# Altium schematic sheet Main.SchDoc
size A2
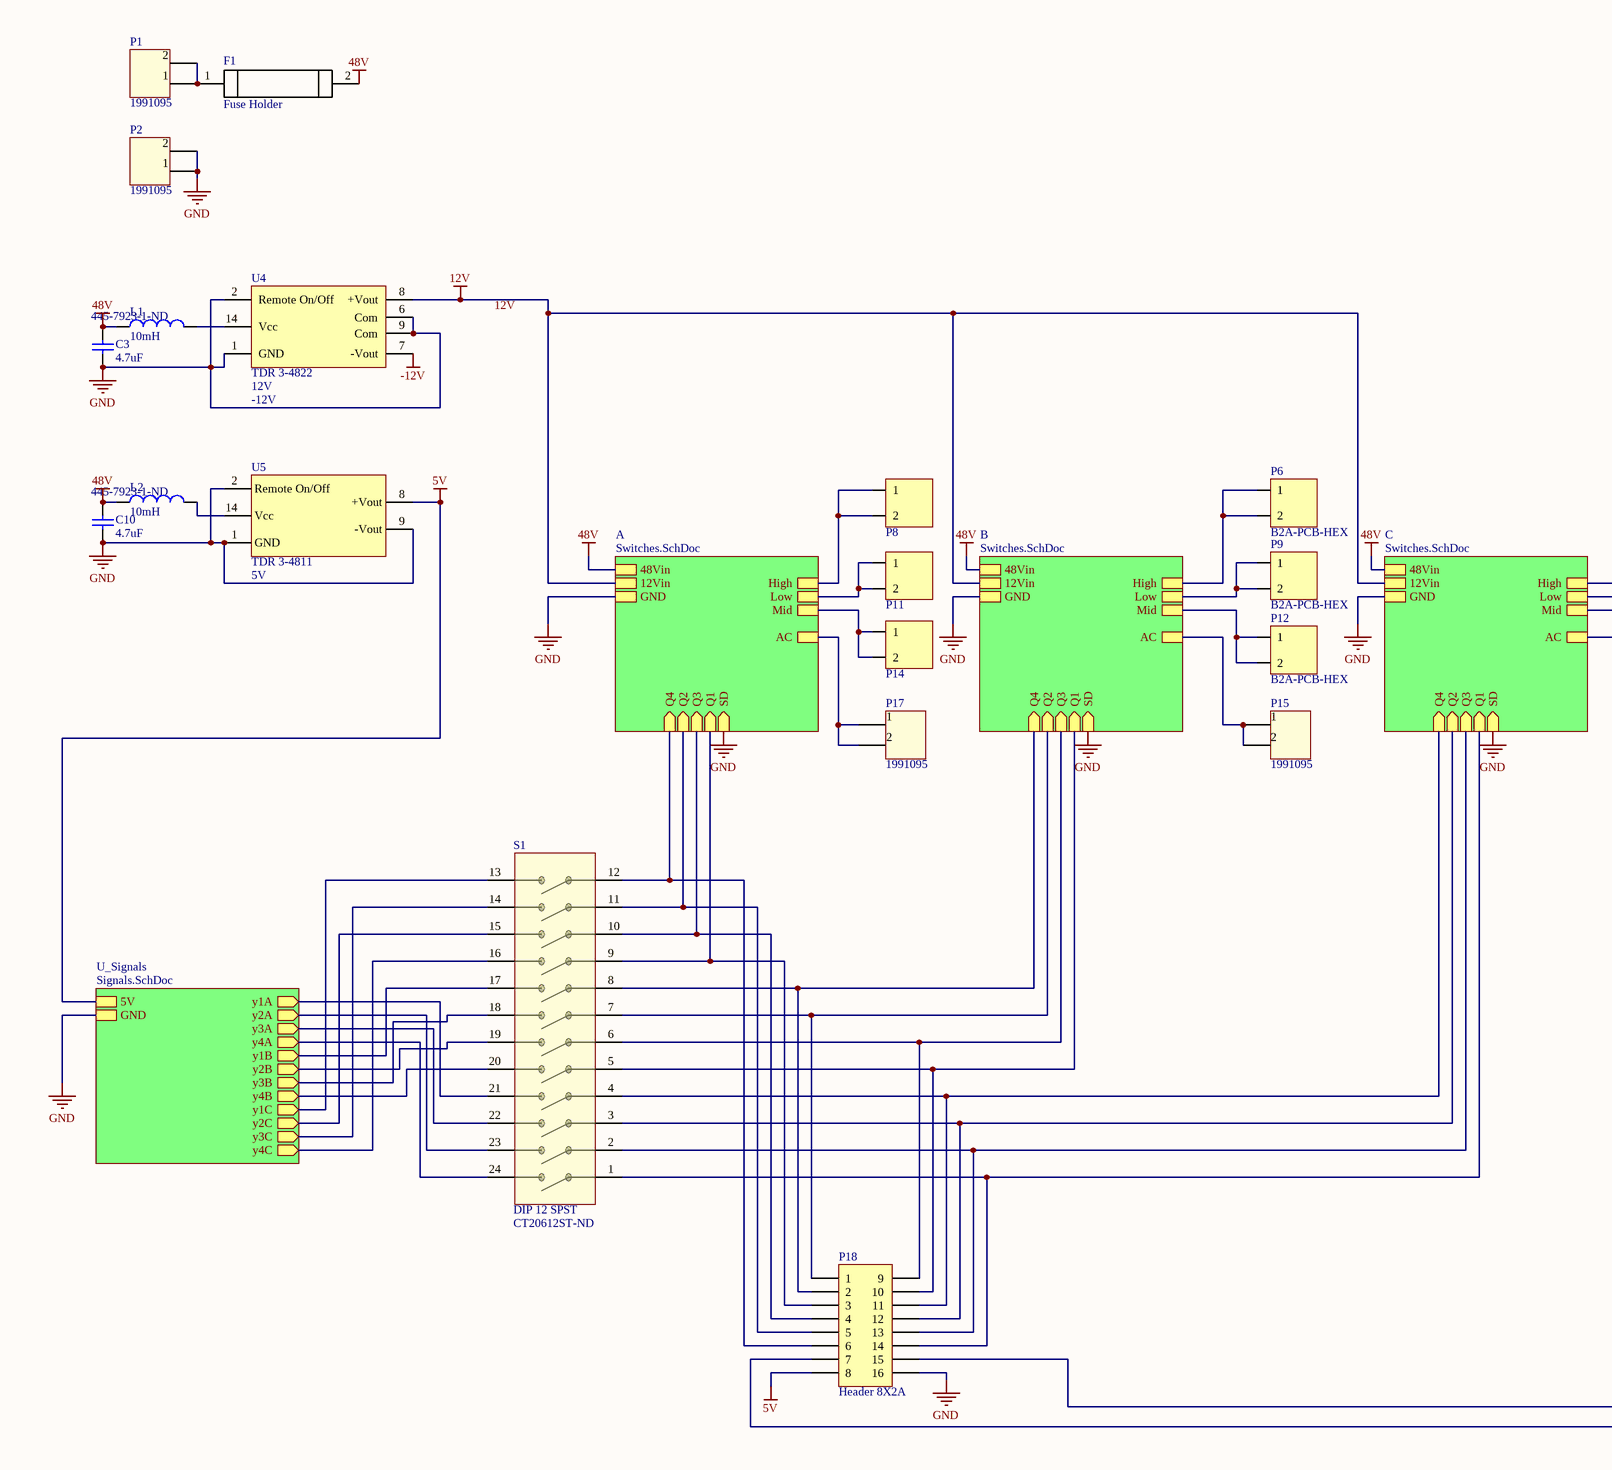
[diagram p0: Main.SchDoc, left]
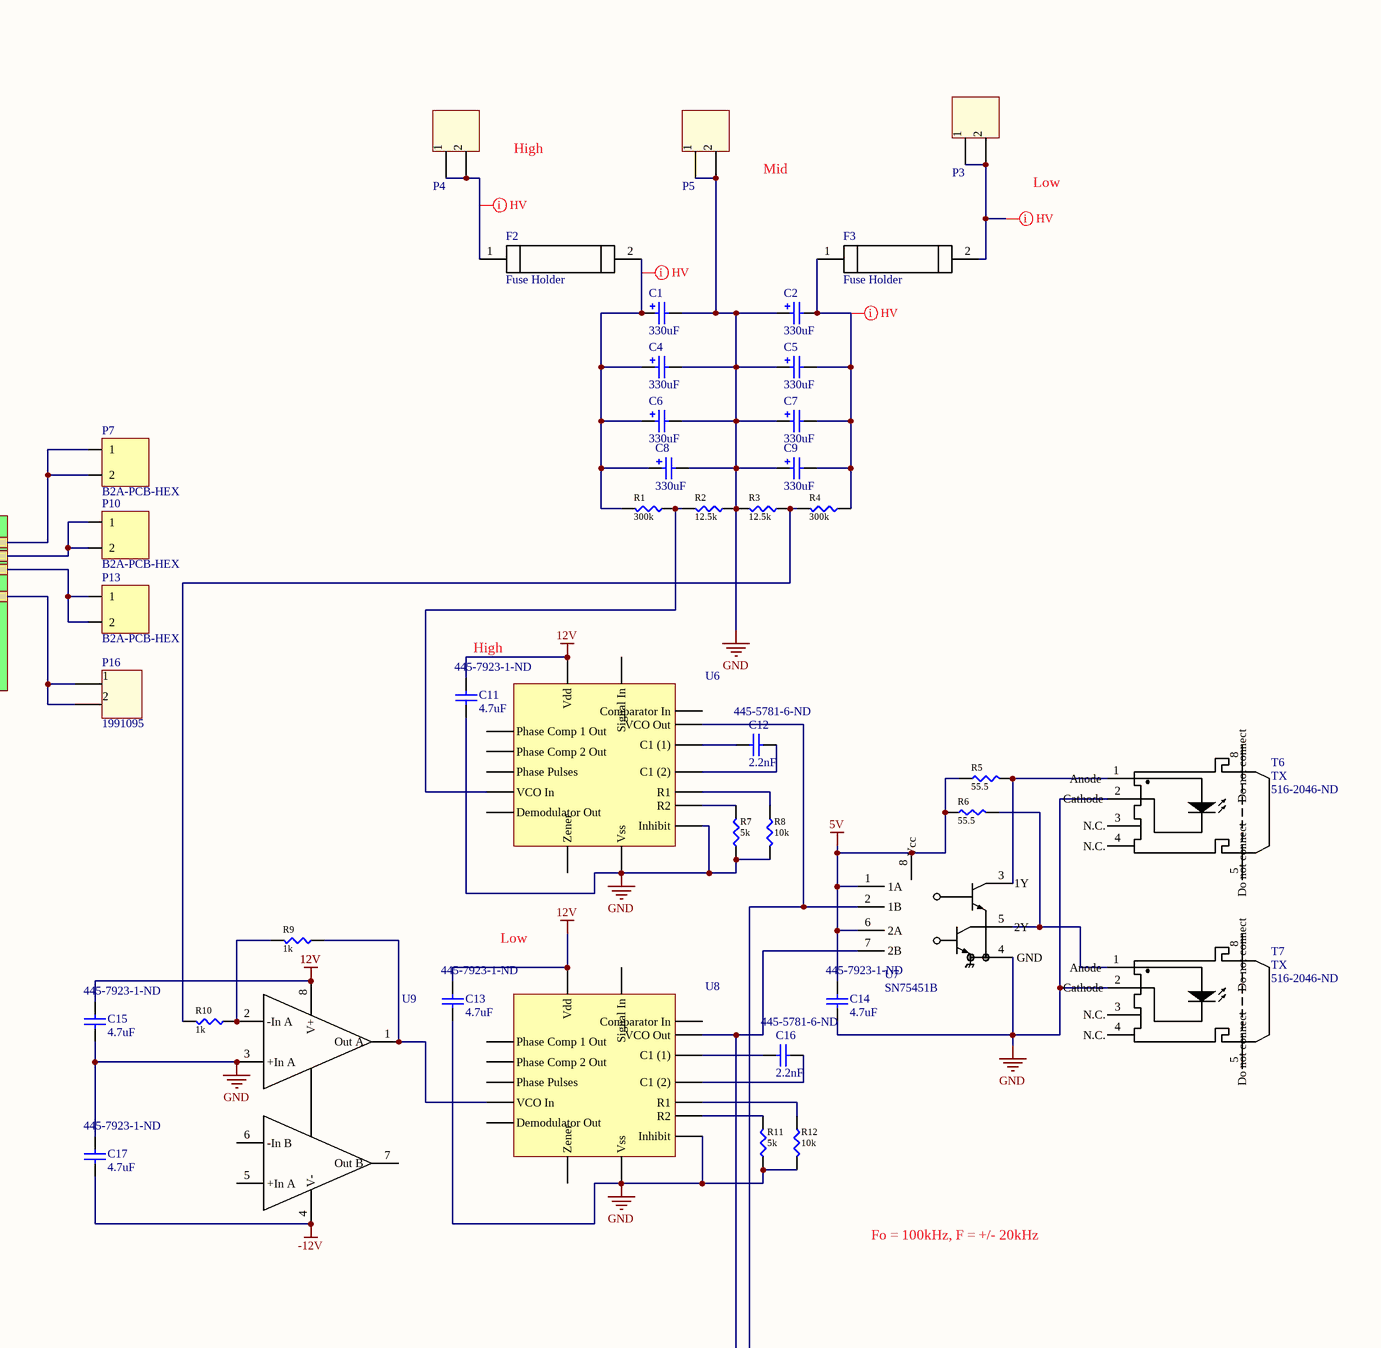
[diagram p1: Main.SchDoc, right]

## Parts
C1  value 330uF  [LGW2G331MELB40]  (hidden comment: Cap Pol1)
C2  value 330uF  [LGW2G331MELB40]  (hidden comment: Cap Pol1)
C3  value 4.7uF  Supplier Part Number 1: 445-7923-1-ND  [C4532]  (hidden comment: Cap)
C4  value 330uF  [LGW2G331MELB40]  (hidden comment: Cap Pol1)
C5  value 330uF  [LGW2G331MELB40]  (hidden comment: Cap Pol1)
C6  value 330uF  [LGW2G331MELB40]  (hidden comment: Cap Pol1)
C7  value 330uF  [LGW2G331MELB40]  (hidden comment: Cap Pol1)
C8  value 330uF  [LGW2G331MELB40]  (hidden comment: Cap Pol1)
C9  value 330uF  [LGW2G331MELB40]  (hidden comment: Cap Pol1)
C10  value 4.7uF  Supplier Part Number 1: 445-7923-1-ND  [C4532]  (hidden comment: Cap)
C11  value 4.7uF  Supplier Part Number 1: 445-7923-1-ND  [C4532]  (hidden comment: Cap)
C12  value 2.2nF  Supplier Part Number 1: 445-5781-6-ND  [R_1206]  (hidden comment: Cap)
C13  value 4.7uF  Supplier Part Number 1: 445-7923-1-ND  [C4532]  (hidden comment: Cap)
C14  value 4.7uF  Supplier Part Number 1: 445-7923-1-ND  [C4532]  (hidden comment: Cap)
C15  value 4.7uF  Supplier Part Number 1: 445-7923-1-ND  [C4532]  (hidden comment: Cap)
C16  value 2.2nF  Supplier Part Number 1: 445-5781-6-ND  [R_1206]  (hidden comment: Cap)
C17  value 4.7uF  Supplier Part Number 1: 445-7923-1-ND  [C4532]  (hidden comment: Cap)
F1  Fuse Holder  [Small Fuse Holder]
F2  Fuse Holder  [Fuse footprint]
F3  Fuse Holder  [Fuse footprint]
L1  value 10mH  [TCK-047]  (hidden comment: Inductor)
L2  value 10mH  [TCK-047]  (hidden comment: Inductor)
P1  1991095  [Terminal Pad]
P2  1991095  [Terminal Pad]
P3  1991095  [Terminal Pad]  (value not drawn)
P4  1991095  [Terminal Pad]  (value not drawn)
P5  1991095  [Terminal Pad]  (value not drawn)
P6  B2A-PCB-HEX  [Terminal Pad]
P7  B2A-PCB-HEX  [Terminal Pad]
P8  B2A-PCB-HEX  [Terminal Pad]  (value not drawn)
P9  B2A-PCB-HEX  [Terminal Pad]
P10  B2A-PCB-HEX  [Terminal Pad]
P11  B2A-PCB-HEX  [Terminal Pad]  (value not drawn)
P12  B2A-PCB-HEX  [Terminal Pad]
P13  B2A-PCB-HEX  [Terminal Pad]
P14  B2A-PCB-HEX  [Terminal Pad]  (value not drawn)
P15  1991095  [Terminal Pad]
P16  1991095  [Terminal Pad]
P17  1991095  [Terminal Pad]
P18  Header 8X2A  [302-S161]
R1  300k  [R_1206]
R2  12.5k  [R_1206]
R3  12.5k  [R_1206]
R4  300k  [R_1206]
R5  55.5  [R_1206]
R6  55.5  [R_1206]
R7  5k  [R_1206]
R8  10k  [R_1206]
R9  1k  [R_1206]
R10  1k  [R_1206]
R11  5k  [R_1206]
R12  10k  [R_1206]
S1  DIP 12 SPST  Supplier Part Number 1: CT20612ST-ND  [DIP12 SPST]
T6  TX  Supplier Part Number 1: 516-2046-ND  [Optics]
T7  TX  Supplier Part Number 1: 516-2046-ND  [Optics]
U4  TDR 3-4822  Voltage - Output 1: 12V  Voltage - Output 2: -12V  [PID DC-DC Converter - duplicate]
U5  TDR 3-4811  Voltage - Output 1: 5V  [PID DC-DC Converter - duplicate]
U6  CD4046B  [DIP16]  (value not drawn)
U7  SN75451B  [R-PDIP-T8]
U8  CD4046B  [DIP16]  (value not drawn)
U9  LT1057CN8  [N8 PDIP]  (value not drawn)

## Sub-sheets
A = Switches.SchDoc: High, Low, Mid, AC, SD (in), 12Vin, GND, 48Vin, Q1 (in), Q3 (in), Q2 (in), Q4 (in)
B = Switches.SchDoc: High, Low, Mid, AC, SD (in), 12Vin, GND, 48Vin, Q1 (in), Q3 (in), Q2 (in), Q4 (in)
C = Switches.SchDoc: High, Low, Mid, AC, SD (in), 12Vin, GND, 48Vin, Q4 (in), Q2 (in), Q3 (in), Q1 (in)
U_Signals = Signals.SchDoc: 5V, GND, y1A (out), y2A (out), y3A (out), y4A (out), y1B (out), y2B (out), y3B (out), y4B (out), y1C (out), y2C (out), y3C (out), y4C (out)

## Nets
5V: C14.2 P18.8 R5.2 R6.2 U5.8(+Vout) U7.1(1A) U7.6(2A) U7.8(Vcc) ; sheet U_Signals/5V
12V: C11.2 C13.2 C15.2 U4.8(+Vout) U6.16(Vdd) U8.16(Vdd) U9.8(V+) ; sheet A/12Vin, sheet B/12Vin, sheet C/12Vin
48V: C3.2 C10.2 F1.2 L1.1 L2.1 ; sheet A/48Vin, sheet B/48Vin, sheet C/48Vin
-12V: C17.1 U4.7(-Vout) U9.4(V-)
GND: C1.2 C2.1 C3.1 C4.2 C5.1 C6.2 C7.1 C8.2 C9.1 C10.1 C11.1 C13.1 C14.1 C15.1 C17.2 P2.1 P2.2 P5.1 P5.2 P18.16 R2.2 R3.1 R7.2 R8.1 R11.2 R12.1 T6.2(Cathode) T7.2(Cathode) U4.1(GND) U4.2(Remote_On/Off) U4.6(Com) U4.9(Com) U5.1(GND) U5.2(Remote_On/Off) U5.9(-Vout) U6.5(Inhibit) U6.8(Vss) U7.4(GND) U8.5(Inhibit) U8.8(Vss) U9.3(+In_A) ; sheet A/SD, sheet A/GND, sheet B/SD, sheet B/GND, sheet C/SD, sheet C/GND, sheet U_Signals/GND
NetC1_1: C1.1 C4.1 C6.1 C8.1 F2.2 R1.1
NetC2_2: C2.2 C5.2 C7.2 C9.2 F3.1 R4.2
NetC12_1: C12.1 U6.6(C1_(1))
NetC12_2: C12.2 U6.7(C1_(2))
NetC16_1: C16.1 U8.6(C1_(1))
NetC16_2: C16.2 U8.7(C1_(2))
NetF1_1: F1.1 P1.1 P1.2
NetF2_1: F2.1 P4.1 P4.2
NetF3_2: F3.2 P3.1 P3.2
NetL1_2: L1.2 U4.14(Vcc)
NetL2_2: L2.2 U5.14(Vcc)
NetP6_1: P6.1 P6.2 ; sheet B/High
NetP7_1: P7.1 P7.2 ; sheet C/High
NetP8_1: P8.1 P8.2 ; sheet A/High
NetP9_1: P9.1 P9.2 ; sheet B/Low
NetP10_1: P10.1 P10.2 ; sheet C/Low
NetP11_1: P11.1 P11.2 ; sheet A/Low
NetP12_1: P12.1 P12.2 ; sheet B/Mid
NetP13_1: P13.1 P13.2 ; sheet C/Mid
NetP14_1: P14.1 P14.2 ; sheet A/Mid
NetP15_1: P15.1 P15.2 ; sheet B/AC
NetP16_1: P16.1 P16.2 ; sheet C/AC
NetP17_1: P17.1 P17.2 ; sheet A/AC
NetP18_1: P18.1 S1.7 ; sheet B/Q2
NetP18_2: P18.2 S1.8 ; sheet B/Q4
NetP18_3: P18.3 S1.9 ; sheet A/Q1
NetP18_4: P18.4 S1.10 ; sheet A/Q3
NetP18_5: P18.5 S1.11 ; sheet A/Q2
NetP18_6: P18.6 S1.12 ; sheet A/Q4
NetP18_7: P18.7 U6.4(VCO_Out) U7.2(1B)
NetP18_9: P18.9 S1.6 ; sheet B/Q3
NetP18_10: P18.10 S1.5 ; sheet B/Q1
NetP18_11: P18.11 S1.4 ; sheet C/Q4
NetP18_12: P18.12 S1.3 ; sheet C/Q2
NetP18_13: P18.13 S1.2 ; sheet C/Q3
NetP18_14: P18.14 S1.1 ; sheet C/Q1
NetP18_15: P18.15 U7.7(2B) U8.4(VCO_Out)
NetR1_2: R1.2 R2.1 U6.9(VCO_In)
NetR3_2: R3.2 R4.1 R10.1
NetR5_1: R5.1 T6.1(Anode) U7.3(1Y)
NetR6_1: R6.1 T7.1(Anode) U7.5(2Y)
NetR7_1: R7.1 U6.12(R2)
NetR8_2: R8.2 U6.11(R1)
NetR9_1: R9.1 R10.2 U9.2(-In_A)
NetR9_2: R9.2 U8.9(VCO_In) U9.1(Out_A)
NetR11_1: R11.1 U8.12(R2)
NetR12_2: R12.2 U8.11(R1)
NetS1_13: S1.13 ; sheet U_Signals/y1C
NetS1_14: S1.14 ; sheet U_Signals/y3C
NetS1_15: S1.15 ; sheet U_Signals/y2C
NetS1_16: S1.16 ; sheet U_Signals/y4C
NetS1_17: S1.17 ; sheet U_Signals/y1B
NetS1_18: S1.18 ; sheet U_Signals/y3B
NetS1_19: S1.19 ; sheet U_Signals/y2B
NetS1_20: S1.20 ; sheet U_Signals/y4B
NetS1_21: S1.21 ; sheet U_Signals/y1A
NetS1_22: S1.22 ; sheet U_Signals/y3A
NetS1_23: S1.23 ; sheet U_Signals/y2A
NetS1_24: S1.24 ; sheet U_Signals/y4A

Not connected (* = marked no-connect by the designer): T6 3(N.C.) 4(N.C.) 5(Do_not_connect) 8(Do_not_connect); T7 3(N.C.) 4(N.C.) 5(Do_not_connect) 8(Do_not_connect); U6 1(Phase_Pulses) 2(Phase_Comp_1_Out) 3(Comparator_In) 10(Demodulator_Out) 13(Phase_Comp_2_Out) 14(Signal_In) 15(Zener); U8 1(Phase_Pulses) 2(Phase_Comp_1_Out) 3(Comparator_In) 10(Demodulator_Out) 13(Phase_Comp_2_Out) 14(Signal_In) 15(Zener); U9 5(+In_A) 6(-In_B) 7(Out_B)

## Layout directives
net class HV: NetC1_1, NetC2_2, NetF2_1, NetF3_2

## Notes on the sheet
- (near P4) High
- (near P5) Mid
- Low
- High
- Fo = 100kHz, F = +/- 20kHz
- Labels drawn without touching a wire or pin: 12V

## Library data of the parts
C1 C2 C4-C9 = Cap Pol1: Polarized Capacitor (Radial); Manufacturer: Nichicon; Voltage Rating: 400V; Tolerance: 20%; Ripple Current: 2.33A; Polarity: Polar; Leakage Current: 1.08mA; Life (Hours): 3000Hour; Lead Diameter: 0.8mm; Published: 8-Jun-2000; LatestRevisionDate: 17-Jul-2002; LatestRevisionNote: Re-released for DXP Platform.; PackageReference: RB7.6-15; Publisher: Altium Limited; PackageDescription: Polarized Capacitor (Radial); 2 Leads; Supplier 1: Digi-Key; Supplier Part Number 1: 493-3229-ND; Manufacturer Part Number: LGW2G331MELB40; Stock 1: 0; Pricing 1: 1=6.67, 10=5.926, 100=4.7406, 500=4.074, 1000=3.8377 (USD); Mount: Through Hole; Case/Package: Radial; Min Operating Temperature: -25°C; Max Operating Temperature: 105°C; Package Quantity: 200; Capacitance: 330uF; Packaging: Bulk; Termination: Snap in; Voltage: 400V; Diameter: 30mm; Length: 40mm; Height: 40mm; Lead Pitch: 10mm; Height - Seated (Max): 1.575inch; ComponentLink1URL: https://datasheet.ciiva.com/101/e-gw-101040.pdf; ComponentLink1Description: https://datasheet.ciiva.com/101/e-gw-101040.pdf; ComponentLink2URL: https://datasheet.ciiva.com/5376/e-gw-28778-5376397.pdf; ComponentLink2Description: https://datasheet.ciiva.com/5376/e-gw-28778-5376397.pdf
C3 C10 C11 C13-C15 C17 = Cap: Capacitor; Manufacturer: TDK; Manufacturer Part Number: CGA8N3X7S2A475K230KB; Tolerance: 10%; Voltage Rating: 100V; Dielectric: X7S; Published: 8-Jun-2000; LatestRevisionDate: 17-Jul-2002; LatestRevisionNote: Re-released for DXP Platform.; PackageReference: RAD-0.3; Publisher: Altium Limited; PackageDescription: Radial Cap, Thru-Hole; 2 Leads; 0.3 in Pin Spacing; Supplier 1: Digi-Key; Pricing 1: 1=1.92, 10=1.518, 100=1.1385 (USD); Case/Package: 1812; Weight: 0.000952oz; Case Code (Metric): 4532; Case Code (Imperial): 1812; Min Operating Temperature: -55°C; Max Operating Temperature: 125°C; Packaging: Tape and Reel; Capacitance: 4.7uF; Termination: SMD/SMT; Package Quantity: 1; Voltage Rating (DC): 100V; Composition: Ceramic; Length: 4.5mm; Height: 1.6mm; Width: 0.126inch; Thickness: 0.091inch; Depth: 3.2mm; REACH SVHC: No SVHC; ComponentLink1URL: https://datasheet.ciiva.com/24217/cga8n3x7s2a475k230kb-266118-24217101.pdf; ComponentLink1Description: https://datasheet.ciiva.com/24217/cga8n3x7s2a475k230kb-266118-24217101.pdf
  C3 C10: Stock 1: 236
  C11 C13-C15 C17: Stock 1: 0
C12 C16 = Cap: Capacitor; Manufacturer: TDK; Manufacturer Part Number: CGA5C4C0G2J221J060AA; Capacitance: 220pF; Tolerance: 5%; Voltage Rating: 630V; Dielectric: C0G; Supplier 1: Digi-Key; Stock 1: 13089; Pricing 1: 1=0.33, 10=0.228, 100=0.129, 500=0.0911, 1000=0.0797 (USD); Case/Package: 1206; Weight: 0.000571oz; Case Code (Metric): 3216; Case Code (Imperial): 1206; Min Operating Temperature: -55°C; Max Operating Temperature: 125°C; Packaging: Tape and Reel; Voltage Rating (DC): 630V; Termination: SMD/SMT; Package Quantity: 1; Composition: Ceramic; Length: 3.2mm; Height: 0.6mm; Width: 0.063inch; Thickness: 0.03inch; Depth: 1.6mm; REACH SVHC: No SVHC; ComponentLink1URL: http://www.farnell.com/datasheets/2130384.pdf; ComponentLink1Description: http://www.farnell.com/datasheets/2130384.pdf; ComponentLink2URL: http://components.arrow.com/part/dataview/57435972S460237N1165; ComponentLink2Description: http://components.arrow.com/part/dataview/57435972S460237N1165; ComponentLink3URL: http://components.arrow.com/part/dataview/0323_06888476; ComponentLink3Description: http://components.arrow.com/part/dataview/0323_06888476; ComponentLink4URL: http://www.mouser.com/ds/2/400/lcc_automotive_midvoltage_en-355485.pdf; ComponentLink4Description: http://www.mouser.com/ds/2/400/lcc_automotive_midvoltage_en-355485.pdf; ComponentLink5URL: http://product.tdk.com/en/catalog/spec/mlccspec_automotive_general_midvoltage_en.pdf; ComponentLink5Description: http://product.tdk.com/en/catalog/spec/mlccspec_automotive_general_midvoltage_en.pdf; ComponentLink6URL: http://www.farnell.com/datasheets/1807242.pdf; ComponentLink6Description: http://www.farnell.com/datasheets/1807242.pdf; ComponentLink7URL: http://www.tdk.co.jp/tefe02/e413_cga.pdf; ComponentLink7Description: http://www.tdk.co.jp/tefe02/e413_cga.pdf
F1-F3 = Fuse Holder: Manufacturer: Littelfuse; Manufacturer Part Number: 01220093Z; Body Material: Copper; Material: Copper,Tin; Current Rating: 30A; Voltage Rating: 250V; Number of Circuits: 1; Supplier 1: Digi-Key; Stock 1: 10489; Pricing 1: 1=0.72, 5=0.696, 10=0.674, 50=0.5672, 100=0.4708, 250=0.428, 500=0.3638, 1000=0.321, 5000=0.2889 (USD); Mount: Horizontal,PCB; Packaging: Bulk; Package Quantity: 1000; Termination: PC Pin; Voltage: 250V; Length: 7.11mm; Height: 10.67mm; Width: 7.87mm; Depth: 9.4mm; Lead Free: Lead Free; ComponentLink1URL: https://datasheet.ciiva.com/295/littelfuse-fuse-clips-295529.pdf; ComponentLink1Description: https://datasheet.ciiva.com/295/littelfuse-fuse-clips-295529.pdf; Supplier Part Number 1: F4185-ND
L1 L2 = Inductor: Code_IEC: 1005; Published: 8-Jun-2000; LatestRevisionDate: 29-May-2009; LatestRevisionNote: IPC-7351 Footprint Added.; PackageReference: 0402-A; Publisher: Altium Limited; PackageDescription: Chip Inductor; Code_JEITA: 0402
P1-P5 P15-P17 = Terminal Block 2: 2 way terminal block; Manufacturer: Phoenix Contact; Number of Contacts: 2; Wire Gauge (Max): 24AWG; Wire Gauge (Min): 12AWG; Voltage Rating: 400V; Current Rating: 24A; Number of Levels: 1; Current: 20A; Voltage: 300V; Pitch: 5mm; Approvals: UL; Supplier 1: Digi-Key; Manufacturer Part Number: 1991095; Stock 1: 1914; Pricing 1: 1=1.13, 10=1.078, 50=1.0486, 100=0.98, 250=0.9016, 500=0.833, 1000=0.7938, 2500=0.7448 (USD); Mount: Through Hole; Weight: 0.102294oz; Colour: Green; Housing Colour: Green; Housing Material: Nylon; Termination: Screwless; Package Quantity: 100; Packaging: Bulk; Number of Poles: 2; Number of Positions Per Level: 2; Number of Positions: 2; Number of Rows: 1; Max Current Rating: 24A; Number of Circuits: 2; Orientation: Straight; Length: 11.4mm; Width: 14.4mm; Depth: 13.5mm; Lead Free: Lead Free; ComponentLink1URL: https://datasheet.ciiva.com/6752/1991095-6752880.pdf; ComponentLink1Description: https://datasheet.ciiva.com/6752/1991095-6752880.pdf; ComponentLink2URL: https://datasheet.ciiva.com/16051/1991095-16051374.pdf; ComponentLink2Description: https://datasheet.ciiva.com/16051/1991095-16051374.pdf; ComponentLink3URL: https://datasheet.ciiva.com/29222/774864-da-01-en-printklemme-1991095-100-st-29222380.pdf; ComponentLink3Description: https://datasheet.ciiva.com/29222/774864-da-01-en-printklemme-1991095-100-st-29222380.pdf; Supplier Part Number 1: 277-6267-ND
P18 = Header 8X2A: Header, 8-Pin, Dual row; Manufacturer: On-Shore Technology; Description: 16 Positions Header, Shrouded Connector 0.100" (2.54mm) Through Hole Gold; Number of Positions: 16; Connector Type: Male Pin; Pitch: 0.1inch; LatestRevisionDate: 17-Jul-2002; LatestRevisionNote: Re-released for DXP Platform.; Publisher: Altium Limited; Supplier 1: Digi-Key; Manufacturer Part Number: 302-S161; Stock 1: 8758; Pricing 1: 1=0.4, 10=0.375, 100=0.2622, 500=0.2247, 1000=0.1873, 5000=0.1605, 10000=0.1498 (USD); Mount: Through Hole; Case/Package: 100; Colour: Black; Contact Plating: Gold; Number of Rows: 2; Packaging: Tray; Termination: Solder; Row Spacing: 0.1inch; ComponentLink1URL: https://datasheet.ciiva.com/742/302-sxxx-742189.pdf; ComponentLink1Description: https://datasheet.ciiva.com/742/302-sxxx-742189.pdf
R1-R12 = RES_SMD1: RES SMD 1% 1/4W 1206; Manufacturer: Panasonic Electronic Components; Manufacturer Part Number: ERJ-8ENF9101V; Power (Watts): 0.25W, 1/4W; Temperature Coefficient: ±100ppm/°C; Supplier 1: Digi-Key; RoHS: RoHS Compliant; Category: Resistors; Stock 1: 17632; Pricing 1: 1=0.15, 50=0.0424, 100=0.0313, 250=0.02384, 500=0.01908, 1000=0.01404 (CAD); Packaging: Digi-Reel®; Part Status: Active; Tolerance: ±1%; Composition: Thick Film; Features: Automotive AEC-Q200; Operating Temperature: -55°C ~ 155°C; Package / Case: 1206 (3216 Metric); Supplier Device Package: 1206; Size / Dimension: 0.126" L x 0.063" W (3.20mm x 1.60mm); Height: 0.028" (0.70mm); Number of Terminations: 2; Failure Rate: -; ComponentLink1URL: http://industrial.panasonic.com/www-cgi/jvcr13pz.cgi?E+PZ+3+AOA0002+ERJ8ENF9101V+7+WW; ComponentLink1Description: http://industrial.panasonic.com/www-cgi/jvcr13pz.cgi?E+PZ+3+AOA0002+ERJ8ENF9101V+7+WW; Supplier Part Number 1: P9.10KFDKR-ND
  R1 R4: Value: 300k
  R2 R3: Value: 12.5k
  R5 R6: Value: 55.5
  R7 R11: Value: 5k
  R8 R12: Value: 10k
  R9 R10: Value: 1k
S1 = DIP 12 SPST: Manufacturer: CTS Electrocomponents; Manufacturer Part Number: 206-12ST; Body Material: Plastic; Number of Positions: 12; Voltage Rating (DC): 24V; Max Current Rating: 50mA; Electrical Life: 10000Cycles; Pitch: 0.1inch; Washable: Yes; Supplier 1: Digi-Key; Stock 1: 2620; Pricing 1: 1=1.41, 10=1.33, 25=1.2752, 50=1.194, 100=1.1668, 250=1.0312, 500=0.9769, 1000=0.8684, 5000=0.7598 (USD); Mount: Through Hole; Case/Package: DIP; Contact Plating: Tin,Gold; Contact Material: Copper; Min Operating Temperature: -55°C; Max Operating Temperature: 85°C; Packaging: Rail/Tube; Termination: PC Pin; Throw Configuration: SPST; Package Quantity: 15; Orientation: Straight; Current Rating: 50mA; Length: 1.286inch; Depth: 9.78mm; Terminal Pitch: 2.54mm; Radiation Hardening: No; Lead Free: Lead Free; ComponentLink1URL: https://datasheet.ciiva.com/26926/getdatasheetpartid-771341-26926550.pdf; ComponentLink1Description: https://datasheet.ciiva.com/26926/getdatasheetpartid-771341-26926550.pdf; ComponentLink2URL: https://datasheet.ciiva.com/2864/206-208-2864231.pdf; ComponentLink2Description: https://datasheet.ciiva.com/2864/206-208-2864231.pdf; ComponentLink3URL: https://datasheet.ciiva.com/15184/getdatasheetpartid-112074-15184826.pdf; ComponentLink3Description: https://datasheet.ciiva.com/15184/getdatasheetpartid-112074-15184826.pdf; ComponentLink4URL: https://datasheet.ciiva.com/17068/206-208-17068348.pdf; ComponentLink4Description: https://datasheet.ciiva.com/17068/206-208-17068348.pdf
T6 T7 = HFBR-1524Z: Otical Transmitter; Manufacturer: Broadcom Avago; Wavelength: 660nm; Capacitance: 86pF; Forward Voltage: 1.67V; Data Rate: 1Mbps; Reverse Voltage (DC): 5V; Forward Current: 80mA; Max Output Current: 5.1mA; Rise Time: 80ns; Fall Time: 40ns; Supplier 1: Digikey; Manufacturer Part Number: HFBR-1524Z; Stock 1: 1574; Pricing 1: 1=11.66, 10=10.56, 25=8.36, 100=7.04, 250=6.6, 500=6.05, 1000=5.72 (USD); Mount: Through Hole; Case/Package: 600; Number of Pins: 6; Min Operating Temperature: -40°C; Max Operating Temperature: 85°C; Package Quantity: 200; Supply Voltage: 5V; Packaging: Rail/Tube; Length: 18.8mm; Height: 7.62mm; Width: 10.2mm; Radiation Hardening: No; REACH SVHC: No SVHC; Lead Free: Lead Free; ComponentLink1URL: https://datasheet.ciiva.com/27056/2062150-27056536.pdf; ComponentLink1Description: https://datasheet.ciiva.com/27056/2062150-27056536.pdf; ComponentLink2URL: https://datasheet.ciiva.com/18408/70158101-18408620.pdf; ComponentLink2Description: https://datasheet.ciiva.com/18408/70158101-18408620.pdf; ComponentLink3URL: https://datasheet.ciiva.com/26913/hfbr-1524z-26913686.pdf; ComponentLink3Description: https://datasheet.ciiva.com/26913/hfbr-1524z-26913686.pdf
U4 = TDR 3-4822: 48 +/-12V Converter; Manufacturer: Traco Power; Min Input Voltage (DC): 36V; Max Input Voltage: 75V; Number of Outputs: 2; Max Output Current: 125mA; Nominal Input Voltage: 48V; Efficiency: 82%; Max Output Power: 3W; Isolation Voltage: 1.5kV; Isolation: Isolated; Supplier 1: Newark; Manufacturer Part Number: TDR3-4822; Stock 1: 10; Pricing 1: 1=31.75, 25=29.09, 50=27.03, 100=26.14, 250=25.25 (USD); Case/Package: DIP; Number of Pins: 7; Min Operating Temperature: -40°C; Max Operating Temperature: 85°C; Nominal Output Voltage: -12V; Min Input Voltage: 36V; Max Input Voltage (DC): 75V; Output Voltage: 12V; Output Current: 125mA; Current - Output 1: 125mA; Current - Output 2: 125mA; Packaging: Rail/Tube; Length: 18.9mm; Height: 8.7mm; Width: 12.8mm; Depth: 18.9mm; REACH SVHC: No SVHC; ComponentLink1URL: http://components.arrow.com/part/dataview/0323_02838307; ComponentLink1Description: http://components.arrow.com/part/dataview/0323_02838307; ComponentLink2URL: http://www.farnell.com/datasheets/1763516.pdf; ComponentLink2Description: http://www.farnell.com/datasheets/1763516.pdf; ComponentLink3URL: http://uk.rs-online.com/webdocs/0e35/0900766b80e35ed7.pdf; ComponentLink3Description: http://uk.rs-online.com/webdocs/0e35/0900766b80e35ed7.pdf; ComponentLink4URL: http://docs-usa.electrocomponents.com/techlib:/itc_doclist_US.htm?stockno=7065629; ComponentLink4Description: http://docs-usa.electrocomponents.com/techlib:/itc_doclist_US.htm?stockno=7065629; Supplier Part Number 1: 20X0418
U5 = TDR 3-4811: 48V-5V Converter; Manufacturer: Traco Power; Nominal Input Voltage: 48V; Output Current: 600mA; Number of Outputs: 1; Efficiency: 81%; Min Input Voltage: 36V; Max Input Voltage: 75V; Max Output Power: 3W; Isolation Voltage: 1.5kV; Isolation: Isolated; Supplier 1: Mouser; Manufacturer Part Number: TDR3-4811; Stock 1: 10; Pricing 1: 1=31.28, 10=29.54, 50=25.71, 100=25.71, 1000=25.71, 10000=25.71 (USD); Case/Package: DIP; Number of Pins: 7; Min Operating Temperature: -40°C; Max Operating Temperature: 85°C; Output Voltage: 5V; Nominal Output Voltage: 5V; Max Output Current: 600mA; Min Input Voltage (DC): 36V; Max Input Voltage (DC): 75V; Current - Output 1: 600mA; Packaging: Rail/Tube; Length: 18.9mm; Height: 8.7mm; Width: 12.8mm; Depth: 18.9mm; REACH SVHC: No SVHC; ComponentLink1URL: https://datasheet.ciiva.com/28438/1763516-28438522.pdf; ComponentLink1Description: https://datasheet.ciiva.com/28438/1763516-28438522.pdf; Supplier Part Number 1: 495-TDR3-4811
U6 U8 = CD4046B: VCO; Manufacturer: Texas Instruments; Manufacturer Part Number: CD4046BE; Max Supply Voltage: 18V; Min Supply Voltage: 3V; Number of Elements: 1; Frequency: 2.4MHz; Nominal Supply Current: 10mA; Input: CMOS; PLL: Yes; Supplier 1: Digikey; Stock 1: 1216; Pricing 1: 1=0.56, 10=0.476, 100=0.3556, 500=0.2794, 1000=0.2159 (USD); Mount: Through Hole; Case/Package: DIP; Number of Pins: 16; Weight: 0.03357oz; Contact Plating: Gold; Min Operating Temperature: -55°C; Max Operating Temperature: 125°C; Packaging: Rail/Tube; Number of Circuits: 1; Number of Bits: 1; Package Quantity: 25; Max Frequency: 2.4MHz; Radiation Hardening: No; Lead Free: Lead Free; REACH SVHC: No SVHC; ComponentLink1URL: https://datasheet.ciiva.com/14134/cd4046b-eng-tds-14134658.pdf; ComponentLink1Description: https://datasheet.ciiva.com/14134/cd4046b-eng-tds-14134658.pdf; ComponentLink2URL: https://datasheet.ciiva.com/15153/getdatasheetpartid-241639-15153402.pdf; ComponentLink2Description: https://datasheet.ciiva.com/15153/getdatasheetpartid-241639-15153402.pdf; ComponentLink3URL: https://datasheet.ciiva.com/14247/cd4046b-14247052.pdf; ComponentLink3Description: https://datasheet.ciiva.com/14247/cd4046b-14247052.pdf; ComponentLink4URL: https://datasheet.ciiva.com/26229/cd4046b-mil-26229407.pdf; ComponentLink4Description: https://datasheet.ciiva.com/26229/cd4046b-mil-26229407.pdf; ComponentLink5URL: https://datasheet.ciiva.com/27050/817951-27050191.pdf; ComponentLink5Description: https://datasheet.ciiva.com/27050/817951-27050191.pdf; ComponentLink6URL: https://datasheet.ciiva.com/29297/172880-da-01-en-c-mos-ic-cd4046be-dip16-tid-29297245.pdf; ComponentLink6Description: https://datasheet.ciiva.com/29297/172880-da-01-en-c-mos-ic-cd4046be-dip16-tid-29297245.pdf; Supplier Part Number 1: 296-2052-5-ND
U7 = SN75451B: Dual Peripheral Drivers; Manufacturer: Texas Instruments; Manufacturer Part Number: SN75451BP; Number of Outputs: 2; Output Voltage: 30V; Output Current: 400mA; Propagation Delay: 25ns; Nominal Supply Current: 65mA; Turn-On Delay Time: 8ns; Turn-Off Delay Time: 12ns; Max Input Voltage: 5.5V; Max Power Dissipation: 1W; Min Supply Voltage: 4.75V; Max Supply Voltage: 5.25V; Supplier 1: Digi-Key; Stock 1: 2217; Pricing 1: 1=0.89, 10=0.794, 100=0.6187, 500=0.5111, 1000=0.4035 (USD); Case/Package: PDIP; Number of Pins: 8; Weight: 0.015535oz; Min Operating Temperature: 0°C; Max Operating Temperature: 70°C; Packaging: Rail/Tube; Package Quantity: 50; Number of Drivers: 2; Power Dissipation: 1W; Max Supply Current: 65mA; Length: 9.81mm; Height: 4.57mm; Width: 6.35mm; Radiation Hardening: No; Lead Free: Lead Free; REACH SVHC: No SVHC; ComponentLink1URL: https://datasheet.ciiva.com/1501/1387986-1501952.pdf; ComponentLink1Description: https://datasheet.ciiva.com/1501/1387986-1501952.pdf; ComponentLink2URL: https://datasheet.ciiva.com/1609/slrs021b-1609184.pdf; ComponentLink2Description: https://datasheet.ciiva.com/1609/slrs021b-1609184.pdf; ComponentLink3URL: https://datasheet.ciiva.com/15115/getdatasheetpartid-134903-15115475.pdf; ComponentLink3Description: https://datasheet.ciiva.com/15115/getdatasheetpartid-134903-15115475.pdf; ComponentLink4URL: https://datasheet.ciiva.com/14180/nr645830-645832-e-14180149.pdf; ComponentLink4Description: https://datasheet.ciiva.com/14180/nr645830-645832-e-14180149.pdf; ComponentLink5URL: https://datasheet.ciiva.com/3303/sn75453b-3303271.pdf; ComponentLink5Description: https://datasheet.ciiva.com/3303/sn75453b-3303271.pdf; ComponentLink6URL: https://datasheet.ciiva.com/16470/sn75453b-16470791.pdf; ComponentLink6Description: https://datasheet.ciiva.com/16470/sn75453b-16470791.pdf; ComponentLink7URL: https://datasheet.ciiva.com/26229/sn75453b-26229559.pdf; ComponentLink7Description: https://datasheet.ciiva.com/26229/sn75453b-26229559.pdf; ComponentLink8URL: https://datasheet.ciiva.com/19477/1054748-19477417.pdf; ComponentLink8Description: https://datasheet.ciiva.com/19477/1054748-19477417.pdf; ComponentLink9URL: https://datasheet.ciiva.com/1949/sn75452b-1949982.pdf; ComponentLink9Description: https://datasheet.ciiva.com/1949/sn75452b-1949982.pdf; ComponentLink10URL: https://datasheet.ciiva.com/1501/1829915-1501951.pdf; ComponentLink10Description: https://datasheet.ciiva.com/1501/1829915-1501951.pdf; ComponentLink11URL: https://datasheet.ciiva.com/41462/001014510-da-01-en-ic-dual-peripheral-sn75451bp-pdip-8-tid-41462363.pdf; ComponentLink11Description: https://datasheet.ciiva.com/41462/001014510-da-01-en-ic-dual-peripheral-sn75451bp-pdip-8-tid-41462363.pdf; Supplier Part Number 1: 296-1746-5-ND
U9 = LT1057CN8: Dual Op-Amp; Manufacturer: STMicroelectronics; Manufacturer Part Number: LMV321LICT; Min Supply Voltage: 2.7V; Max Supply Voltage: 5.5V; Voltage Gain: 100dB; Common Mode Rejection Ratio: 72dB; Gain Bandwidth Product: 1.3MHz; Slew Rate: 0.7V/µs; Number of Channels: 1; Output Current: 46mA; Nominal Supply Current: 220uA; Input Bias Current: 27nA; Input Offset Voltage (Vos): 1mV; Operating Supply Current: 130uA; Output Current per Channel: 70mA; Dual Supply Voltage: 9V; Min Dual Supply Voltage: 4V; Max Dual Supply Voltage: 20V; Nominal Gain Bandwidth Product: 5MHz; Power Supply Rejection Ratio (PSRR): 86dB; Max Supply Current: 5.6mA; Number of Amplifiers: 2; Supplier 1: Digi-Key; Stock 1: 42978; Pricing 1: 1=0.45, 10=0.363, 100=0.2472, 500=0.1854, 1000=0.1391 (USD); Mount: Surface Mount; Case/Package: SC; Number of Pins: 5; Contact Plating: Tin; Min Operating Temperature: -40°C; Max Operating Temperature: 125°C; Package Quantity: 1; Packaging: Tape and Reel; Number of Circuits: 1; Number of Elements: 1; Unity Gain Bandwidth Product: 1.3MHz; Radiation Hardening: No; Lead Free: Lead Free; ComponentLink1URL: https://datasheet.ciiva.com/6629/dm00052423-6629957.pdf; ComponentLink1Description: https://datasheet.ciiva.com/6629/dm00052423-6629957.pdf; ComponentLink2URL: https://datasheet.ciiva.com/6629/dm00052423-6629958.pdf; ComponentLink2Description: https://datasheet.ciiva.com/6629/dm00052423-6629958.pdf; ComponentLink3URL: https://datasheet.ciiva.com/13063/dm00052423-100852-13063497.pdf; ComponentLink3Description: https://datasheet.ciiva.com/13063/dm00052423-100852-13063497.pdf; ComponentLink4URL: https://datasheet.ciiva.com/16394/dm00052423-16394346.pdf; ComponentLink4Description: https://datasheet.ciiva.com/16394/dm00052423-16394346.pdf; ComponentLink5URL: https://datasheet.ciiva.com/2966/dm00052423-2966011.pdf; ComponentLink5Description: https://datasheet.ciiva.com/2966/dm00052423-2966011.pdf; ComponentLink6URL: https://datasheet.ciiva.com/41459/001184777-da-01-en-ic-op-amp-sgl-r-r-lmv321lict-sc-70-5-stm-41459586.pdf; ComponentLink6Description: https://datasheet.ciiva.com/41459/001184777-da-01-en-ic-op-amp-sgl-r-r-lmv321lict-sc-70-5-stm-41459586.pdf; Supplier Part Number 1: 497-13050-6-ND; Supplier 2: Digi-Key; Stock 2: 1166; Pricing 2: 1=4.92, 25=3.27, 100=2.55 (USD); Bandwidth: 5MHz; Length: 10.16mm; Height: 3.3mm; Width: 6.48mm; REACH SVHC: No SVHC; ComponentLink7URL: https://datasheet.ciiva.com/19474/1728554-19474778.pdf; ComponentLink7Description: https://datasheet.ciiva.com/19474/1728554-19474778.pdf; ComponentLink8URL: https://datasheet.ciiva.com/1794/3824-1794779.pdf; ComponentLink8Description: https://datasheet.ciiva.com/1794/3824-1794779.pdf; ComponentLink9URL: https://datasheet.ciiva.com/5704/1712178-5704285.pdf; ComponentLink9Description: https://datasheet.ciiva.com/5704/1712178-5704285.pdf; ComponentLink10URL: https://datasheet.ciiva.com/26344/679699-da-01-en-ic-lt1057cn8-pbf-pdip-8-ltc-26344373.pdf; ComponentLink10Description: https://datasheet.ciiva.com/26344/679699-da-01-en-ic-lt1057cn8-pbf-pdip-8-ltc-26344373.pdf; Supplier Part Number 2: LT1057CN8#PBF-ND
P6-P14 = B2A-PCB-HEX: URL: https://lugsdirect.com/IHI_HIGH_CURRENT_PCB-TERMINALS-_SELECTION_CHART2.htm#85A; PN: B2A-PCB-HEX